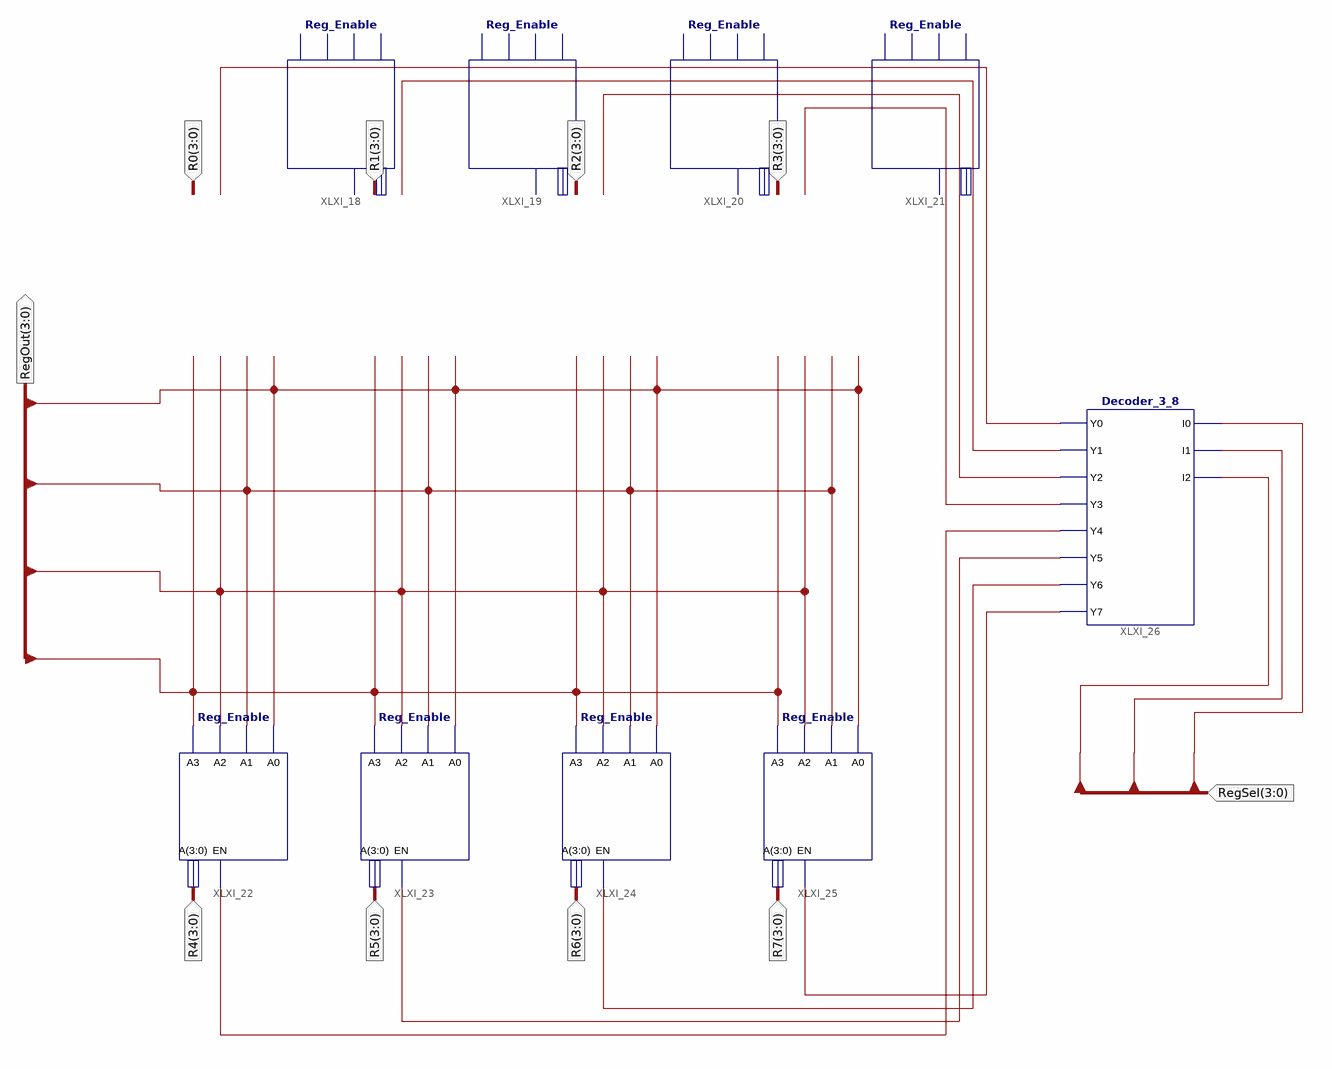
[diagram p0: schematic sheet 1]
// Xilinx ISE schematic Mux_8_way_4_bit.sch (spartan3e) as structural Verilog: 9 symbols, 10 ports
module Mux_8_way_4_bit (
  input  [3:0] R0,
  input  [3:0] R1,
  input  [3:0] R2,
  input  [3:0] R3,
  input  [3:0] R4,
  input  [3:0] R5,
  input  [3:0] R6,
  input  [3:0] R7,
  input  [3:0] RegSel,
  output [3:0] RegOut
);

  wire XLXN_49, XLXN_52, XLXN_54, XLXN_56, XLXN_58, XLXN_60, XLXN_62, XLXN_64;

  Reg_Enable XLXI_18 (.A(R0), .A0(RegOut[0]), .A1(RegOut[1]), .A2(RegOut[2]), .A3(RegOut[3]), .EN(XLXN_49));
  Reg_Enable XLXI_19 (.A(R1), .A0(RegOut[0]), .A1(RegOut[1]), .A2(RegOut[2]), .A3(RegOut[3]), .EN(XLXN_52));
  Reg_Enable XLXI_20 (.A(R2), .A0(RegOut[0]), .A1(RegOut[1]), .A2(RegOut[2]), .A3(RegOut[3]), .EN(XLXN_54));
  Reg_Enable XLXI_21 (.A(R3), .A0(RegOut[0]), .A1(RegOut[1]), .A2(RegOut[2]), .A3(RegOut[3]), .EN(XLXN_56));
  Reg_Enable XLXI_22 (.A(R4), .A0(RegOut[0]), .A1(RegOut[1]), .A2(RegOut[2]), .A3(RegOut[3]), .EN(XLXN_58));
  Reg_Enable XLXI_23 (.A(R5), .A0(RegOut[0]), .A1(RegOut[1]), .A2(RegOut[2]), .A3(RegOut[3]), .EN(XLXN_60));
  Reg_Enable XLXI_24 (.A(R6), .A0(RegOut[0]), .A1(RegOut[1]), .A2(RegOut[2]), .A3(RegOut[3]), .EN(XLXN_62));
  Reg_Enable XLXI_25 (.A(R7), .A0(RegOut[0]), .A1(RegOut[1]), .A2(RegOut[2]), .A3(RegOut[3]), .EN(XLXN_64));
  Decoder_3_8 XLXI_26 (
    .I0(RegSel[0]), .I1(RegSel[1]), .I2(RegSel[2]), .Y0(XLXN_49), .Y1(XLXN_52), .Y2(XLXN_54), .Y3(XLXN_56),
    .Y4(XLXN_58), .Y5(XLXN_60), .Y6(XLXN_62), .Y7(XLXN_64));
endmodule
